# EAGLE board schematic_March8 (EAGLE 7.6.0)
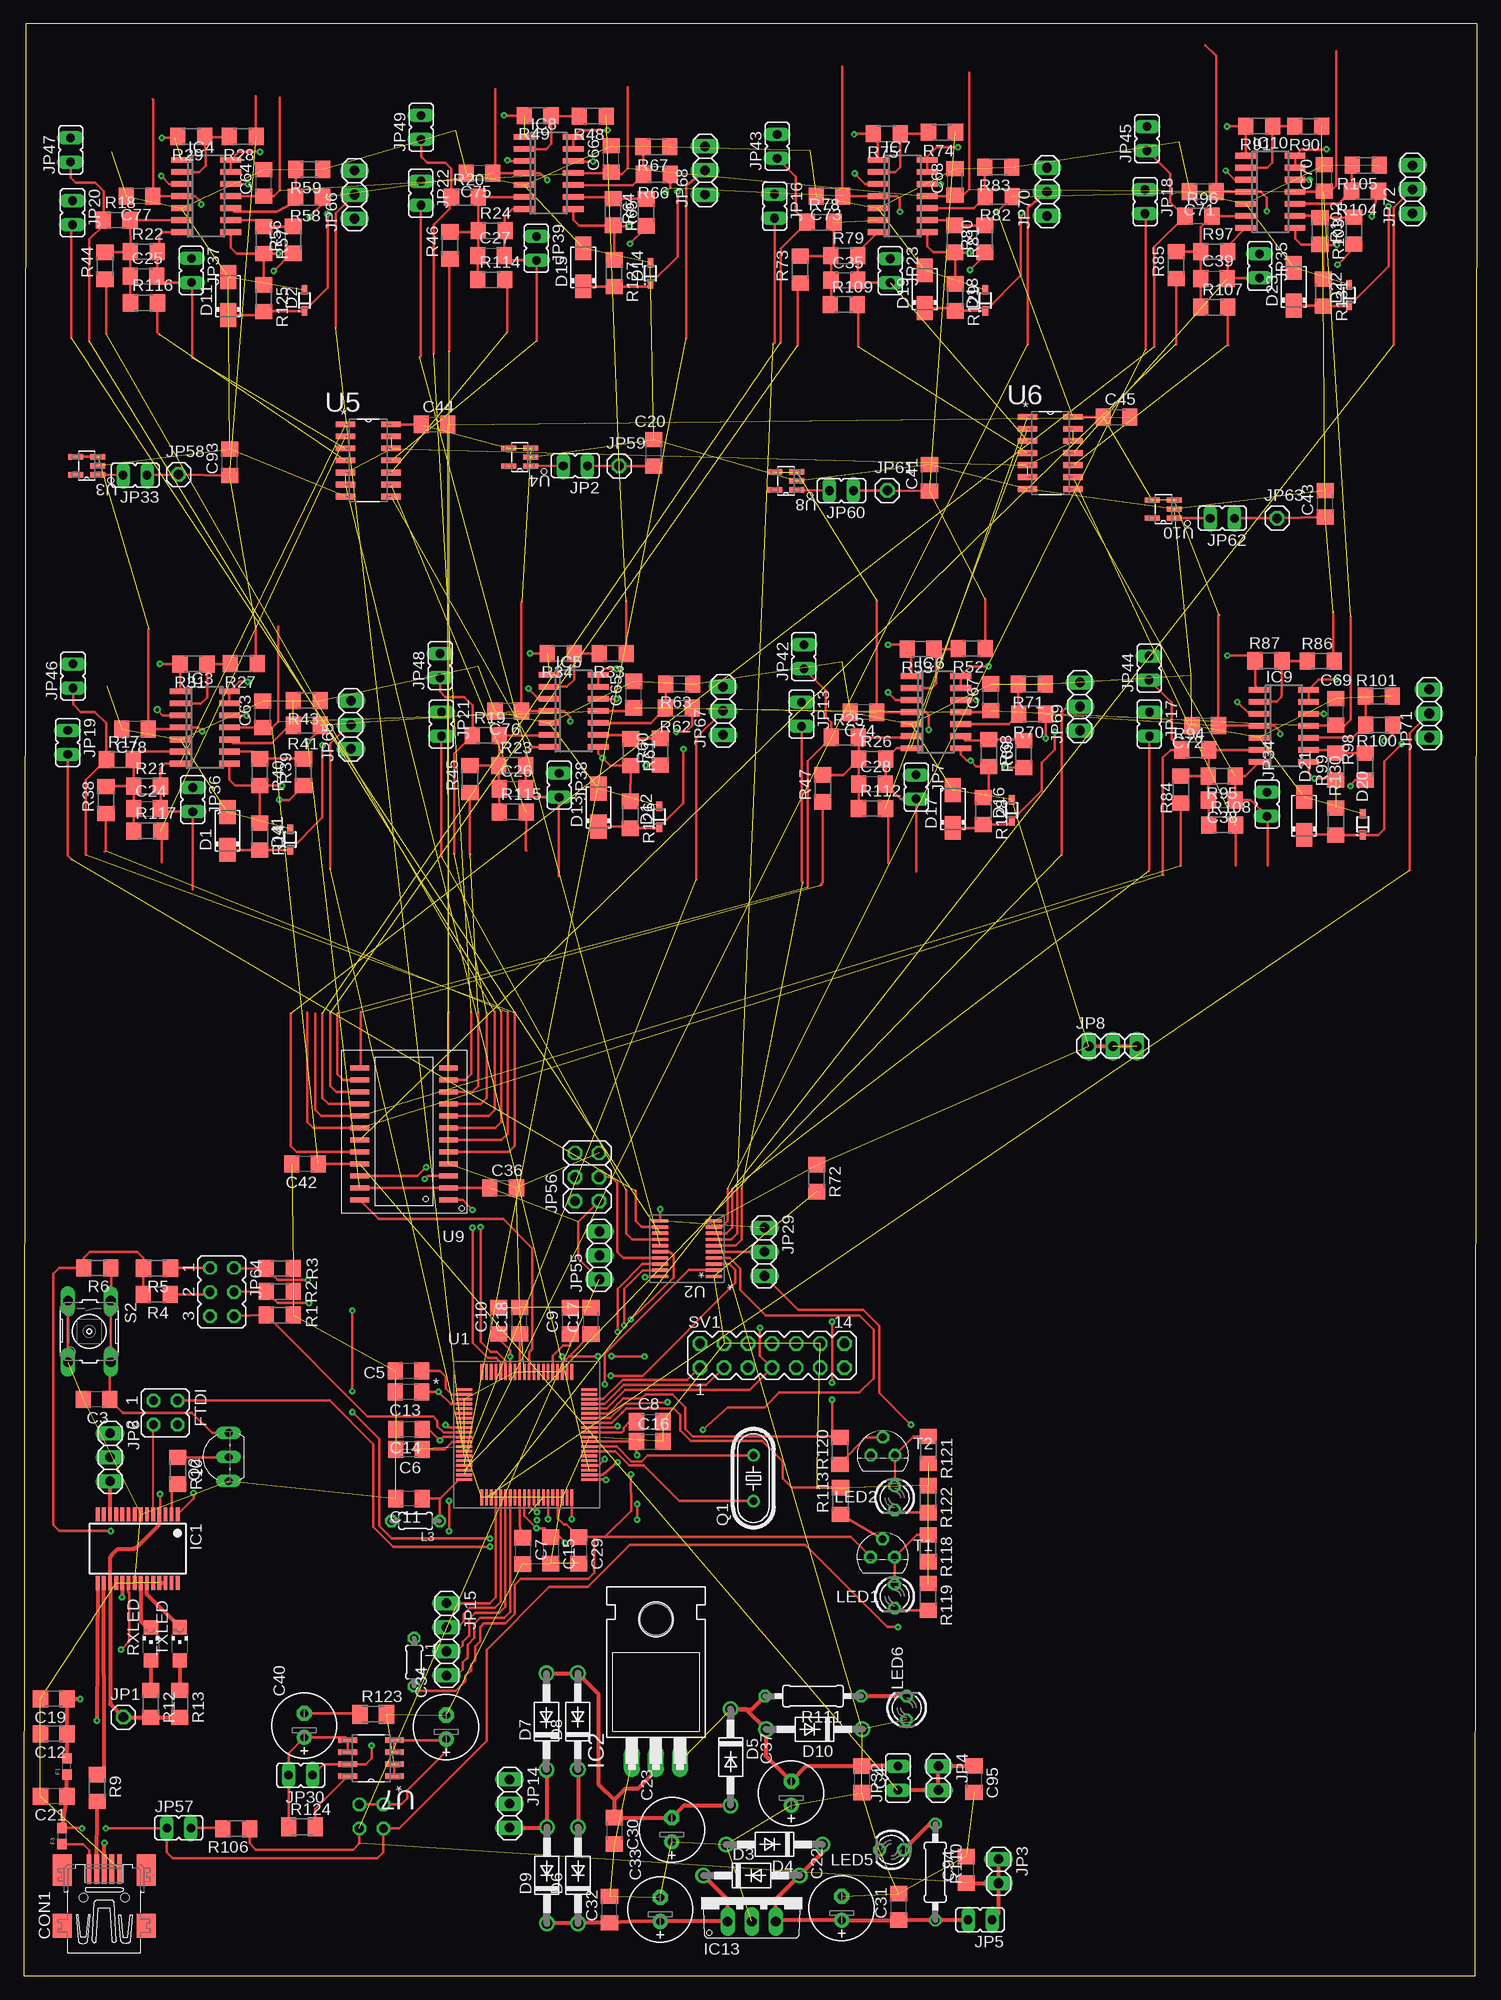
[diagram p2: board, top side]
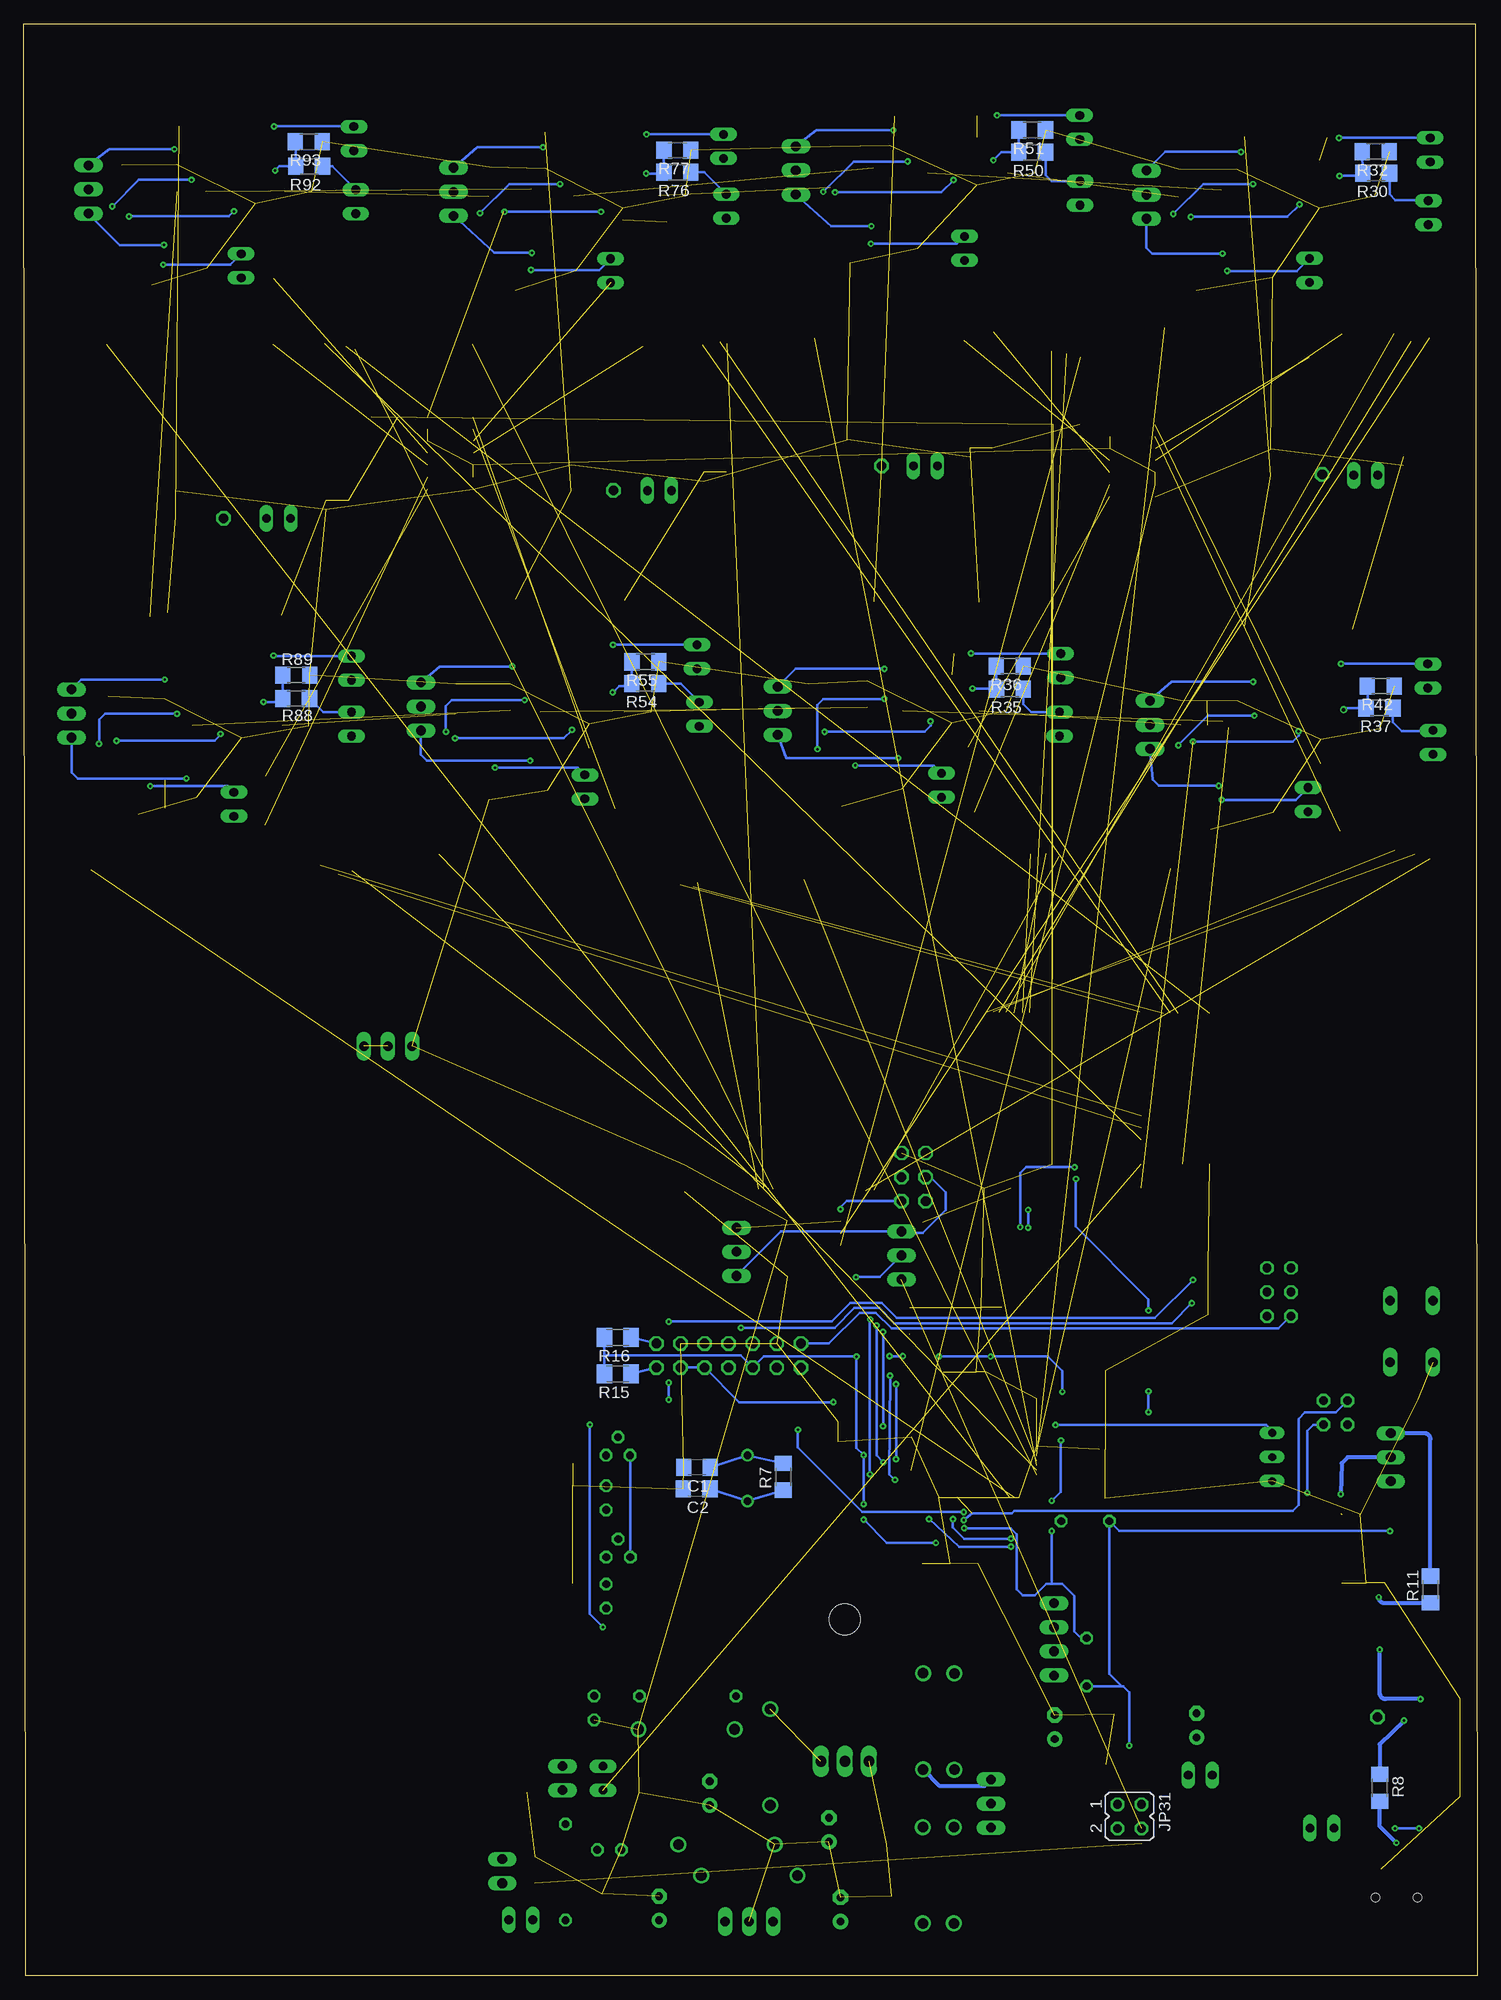
[diagram p3: board, bottom side, seen from below]

Size 153.45 x 206.15 mm. Coordinates in mm from the lower left corner, seen from the top.
Outline: 0,0.03 153.24,0 153.45,206.12 0.2,206.15 0,0.03
Copper layers (1*16): Top 0.035mm / dielectric 1.5mm / Bottom 0.035mm
Design rules "default *": minimum track width 8mil, minimum drill 10mil, track to track 7mil, track to pad 7mil, pad to pad 7mil, via to via 7mil, smd to smd 7mil, copper to edge 10mil, drill to drill 7mil, minimum pad ring 10mil, minimum via ring 8mil, stop-mask expansion 4mil, vias tented up to drill 0mil, thermal gap 10mil
Net classes: 1 power: width 0.254 mm

## Footprints (pad centres in the part's own frame; a part is rotated, then mirrored left to right if it is on the bottom)
C1206 = smd 1.6 x 1.8: 1 -1.4,0; 2 1.4,0
E2,5-7 = drill 0.813 pad 1.6: + -1.27,0 | drill 0.813 pad 1.6 octagon: - 1.27,0
32005-201 = smd 3.1 x 0.5: 1 3,1.6; 2 3,0.8; 3 3,0; 4 3,-0.8; 5 3,-1.6 | smd 2.5 x 2: M1 -3,-4.45; M2 -3,4.45 | smd 3.3 x 2: M3 2.9,4.45; M4 2.9,-4.45 | hole 0.9: 0,2.2; 0,-2.2
DO214AC = smd 2.5 x 1.7: A 2,0; C -2,0
SOD323F = smd 1 x 0.6: A 1.1,0; C -1.1,0
DO41-10 = drill 1.118: A 5.08,0; C -5.08,0
0603 = smd 1.1 x 1: 1 -0.85,0; 2 0.85,0
JP2Q = drill 0.914 octagon: 1 -1.27,-1.27; 2 1.27,-1.27; 3 -1.27,1.27; 4 1.27,1.27
SSOP28 = smd 0.4 x 1.5: 1 -4.225,-3.625; 2 -3.575,-3.625; 3 -2.925,-3.625; 4 -2.275,-3.625; 5 -1.625,-3.625; 6 -0.975,-3.625; 7 -0.325,-3.625; 8 0.325,-3.625; 9 0.975,-3.625; 10 1.625,-3.625; 11 2.275,-3.625; 12 2.925,-3.625; 13 3.575,-3.625; 14 4.225,-3.625; 15 4.225,3.625; 16 3.575,3.625; 17 2.925,3.625; 18 2.275,3.625; 19 1.625,3.625; 20 0.975,3.625; 21 0.325,3.625; 22 -0.325,3.625; 23 -0.975,3.625; 24 -1.625,3.625; 25 -2.275,3.625; 26 -2.925,3.625; 27 -3.575,3.625; 28 -4.225,3.625
TO220H = drill 1.118 long: 1 -2.54,-10.16; 2 0,-10.16; 3 2.54,-10.16 | hole 3.302: 0,4.826
SO14 = smd 0.6 x 2.2: 1 -3.81,-2.6; 2 -2.54,-2.6; 3 -1.27,-2.6; 4 0,-2.6; 5 1.27,-2.6; 6 2.54,-2.6; 7 3.81,-2.6; 8 3.81,2.6; 9 2.54,2.6; 10 1.27,2.6; 11 0,2.6; 12 -1.27,2.6; 13 -2.54,2.6; 14 -3.81,2.6
TO220V = drill 1.016 long: 1 -2.54,-2.54; 2 0,-2.54; 3 2.54,-2.54
1X01 = drill 1.016 octagon: 1 0,0
JP1 = drill 0.914 long: 1 0,-1.27; 2 0,1.27
1X02 = drill 1.016 long: 1 -1.27,0; 2 1.27,0
1X03 = drill 1.016 long: 1 -2.54,0; 2 0,0; 3 2.54,0
1X04 = drill 1.016 long: 1 -3.81,0; 2 -1.27,0; 3 1.27,0; 4 3.81,0
2X03 = drill 1.016 octagon: 1 -2.54,-1.27; 2 -2.54,1.27; 3 0,-1.27; 4 0,1.27; 5 2.54,-1.27; 6 2.54,1.27
JP3Q = drill 0.914 octagon: 1 -2.54,-1.27; 2 -2.54,1.27; 3 0,-1.27; 4 0,1.27; 5 2.54,-1.27; 6 2.54,1.27
0204/5 = drill 0.813 octagon: 1 -2.54,0; 2 2.54,0
LED3MM = drill 0.813 octagon: A -1.27,0; K 1.27,0
HC49/S = drill 0.813: 1 -2.413,0; 2 2.413,0
TO92-EBC = drill 0.813 long: B 0,-1.27; C -2.54,-1.27; E 2.54,-1.27
R1206 = smd 1.6 x 1.803: 1 -1.422,0; 2 1.422,0
M1206 = smd 1.6 x 2: 1 -1.4,0; 2 1.4,0
0207/10 = drill 0.813 octagon: 1 -5.08,0; 2 5.08,0
CHIPLED_1206 = smd 1.5 x 1.5: A 0,-1.75; C 0,1.75
B3F-10XX = drill 1.016 long: 1 -3.251,2.261; 2 3.251,2.261; 3 -3.251,-2.261; 4 3.251,-2.261
MA07-2 = drill 1.016 octagon: 1 -7.62,-1.27; 2 -7.62,1.27; 3 -5.08,-1.27; 4 -5.08,1.27; 5 -2.54,-1.27; 6 -2.54,1.27; 7 0,-1.27; 8 0,1.27; 9 2.54,-1.27; 10 2.54,1.27; 11 5.08,-1.27; 12 5.08,1.27; 13 7.62,-1.27; 14 7.62,1.27
TO92 = drill 0.813 octagon: 1 1.27,0; 2 0,1.905; 3 -1.27,0
PN80 = smd 1.676 x 0.279: 1 -6.617,4.75; 2 -6.617,4.25; 3 -6.617,3.75; 4 -6.617,3.25; 5 -6.617,2.75; 6 -6.617,2.25; 7 -6.617,1.75; 8 -6.617,1.25; 9 -6.617,0.75; 10 -6.617,0.25; 11 -6.617,-0.25; 12 -6.617,-0.75; 13 -6.617,-1.25; 14 -6.617,-1.75; 15 -6.617,-2.25; 16 -6.617,-2.75; 17 -6.617,-3.25; 18 -6.617,-3.75; 19 -6.617,-4.25; 20 -6.617,-4.75; 41 6.617,-4.75; 42 6.617,-4.25; 43 6.617,-3.75; 44 6.617,-3.25; 45 6.617,-2.75; 46 6.617,-2.25; 47 6.617,-1.75; 48 6.617,-1.25; 49 6.617,-0.75; 50 6.617,-0.25; 51 6.617,0.25; 52 6.617,0.75; 53 6.617,1.25; 54 6.617,1.75; 55 6.617,2.25; 56 6.617,2.75; 57 6.617,3.25; 58 6.617,3.75; 59 6.617,4.25; 60 6.617,4.75 | smd 0.279 x 1.676: 21 -4.75,-6.617; 22 -4.25,-6.617; 23 -3.75,-6.617; 24 -3.25,-6.617; 25 -2.75,-6.617; 26 -2.25,-6.617; 27 -1.75,-6.617; 28 -1.25,-6.617; 29 -0.75,-6.617; 30 -0.25,-6.617; 31 0.25,-6.617; 32 0.75,-6.617; 33 1.25,-6.617; 34 1.75,-6.617; 35 2.25,-6.617; 36 2.75,-6.617; 37 3.25,-6.617; 38 3.75,-6.617; 39 4.25,-6.617; 40 4.75,-6.617; 61 4.75,6.617; 62 4.25,6.617; 63 3.75,6.617; 64 3.25,6.617; 65 2.75,6.617; 66 2.25,6.617; 67 1.75,6.617; 68 1.25,6.617; 69 0.75,6.617; 70 0.25,6.617; 71 -0.25,6.617; 72 -0.75,6.617; 73 -1.25,6.617; 74 -1.75,6.617; 75 -2.25,6.617; 76 -2.75,6.617; 77 -3.25,6.617; 78 -3.75,6.617; 79 -4.25,6.617; 80 -4.75,6.617
PW20 = smd 1.676 x 0.356: 1 -2.819,2.925; 2 -2.819,2.275; 3 -2.819,1.625; 4 -2.819,0.975; 5 -2.819,0.325; 6 -2.819,-0.325; 7 -2.819,-0.975; 8 -2.819,-1.625; 9 -2.819,-2.275; 10 -2.819,-2.925; 11 2.819,-2.925; 12 2.819,-2.275; 13 2.819,-1.625; 14 2.819,-0.975; 15 2.819,-0.325; 16 2.819,0.325; 17 2.819,0.975; 18 2.819,1.625; 19 2.819,2.275; 20 2.819,2.925
DDC0005A_N = smd 1.575 x 0.559: 1 -1.168,0.95; 2 -1.168,0; 3 -1.168,-0.95; 4 1.168,-0.95; 5 1.168,0.95
SOIC127P600X175-14N = smd 2.057 x 0.61: 1 -4.801,7.62; 2 -4.801,6.35; 3 -4.801,5.08; 4 -4.801,3.81; 5 -4.801,2.54; 6 -4.801,1.27; 7 -4.801,0; 8 0,0; 9 0,1.27; 10 0,2.54; 11 0,3.81; 12 0,5.08; 13 0,6.35; 14 0,7.62
SOIC127P600X175-8N = smd 1.981 x 0.559: 1 -2.464,1.905; 2 -2.464,0.635; 3 -2.464,-0.635; 4 -2.464,-1.905; 5 2.464,-1.905; 6 2.464,-0.635; 7 2.464,0.635; 8 2.464,1.905
21-0042B_24 = smd 1.981 x 0.533: 1 -4.686,6.985; 2 -4.686,5.715; 3 -4.686,4.445; 4 -4.686,3.175; 5 -4.686,1.905; 6 -4.686,0.635; 7 -4.686,-0.635; 8 -4.686,-1.905; 9 -4.686,-3.175; 10 -4.686,-4.445; 11 -4.686,-5.715; 12 -4.686,-6.985; 13 4.686,-6.985; 14 4.686,-5.715; 15 4.686,-4.445; 16 4.686,-3.175; 17 4.686,-1.905; 18 4.686,-0.635; 19 4.686,0.635; 20 4.686,1.905; 21 4.686,3.175; 22 4.686,4.445; 23 4.686,5.715; 24 4.686,6.985

## Placement (x,y rotation side)
C1  36p  [C1206]  82.37,53.67 180 bottom
C2  36p  [C1206]  82.4,51.41 180 bottom
C3  0.1u  [C1206]  7.67,60.86 180 top
C4  0.1uF  [C1206]  88.47,20.75 270 top
C5  2.2u  [C1206]  40.64,63.88 180 top
C6  2.2u  [C1206]  40.67,55.6 180 top
C7  2.2u  [C1206]  52.68,44.88 270 top
C8  2.2u  [C1206]  66.09,58.52 0 top
C9  2.2u  [C1206]  57.68,69.16 90 top
C10  2.2u  [C1206]  50.16,69.19 90 top
C11  2.2u  [C1206]  40.67,50.39 180 top
C12  100nF  [C1206]  3.17,25.55 180 top
C13  2.2u  [C1206]  40.64,61.67 180 top
C14  2.2u  [C1206]  40.67,57.71 180 top
C15  2.2u  [C1206]  55.63,44.93 270 top
C16  2.2u  [C1206]  66.09,56.41 0 top
C17  2.2u  [C1206]  59.89,69.16 90 top
C18  2.2u  [C1206]  52.35,69.19 90 top
C19  4.7uF  [C1206]  3.17,29.24 180 top
C20  2.2u  [C1206]  66.5,160.81 90 top
C21  10nF  [C1206]  3.17,18.95 180 top
C22  10uF  [E2,5-7]  86.36,7.14 90 top
C23  1000uF  [E2,5-7]  68.43,15.42 90 top
C24  [C1206]  13.03,123.24 0 top
C25  [C1206]  12.65,179.5 0 top
C26  [C1206]  51.61,125.35 0 top
C27  [C1206]  49.35,181.66 0 top
C28  [C1206]  89.56,125.83 0 top
C29  0.1u  [C1206]  58.6,44.93 270 top
C30  0.1uF  [C1206]  62.36,15.32 270 top
C31  0.1uF  [C1206]  92.38,7.29 90 top
C32  0.1uF  [C1206]  61.85,7.01 90 top
C33  1000uF  [E2,5-7]  67.21,7.01 90 top
C34  0.1uF  [E2,5-7]  44.6,26.26 90 top
C35  [C1206]  86.64,179.04 0 top
C36  2.2u  [C1206]  50.62,83.19 0 top
C37  10uF  [E2,5-7]  81.03,19.28 90 top
C38  [C1206]  126.49,124.16 0 top
C39  [C1206]  125.65,179.22 0 top
C40  10uF  [E2,5-7]  29.62,26.44 90 top
C41  2.2u  [C1206]  95.63,158.19 90 top
C42  2.2u  [C1206]  29.69,85.73 180 top
C43  2.2u  [C1206]  137.41,155.45 90 top
C44  2.2u  [C1206]  43.36,163.83 0 top
C45  2.2u  [C1206]  115.37,164.62 0 top
C63  2.2u  [C1206]  25.25,133.2 90 top
C64  2.2u  [C1206]  25.32,189.33 90 top
C65  2.2u  [C1206]  64.41,135.31 90 top
C66  2.2u  [C1206]  62.03,191.87 90 top
C67  2.2u  [C1206]  102.08,135.03 90 top
C68  2.2u  [C1206]  98.32,189.43 90 top
C69  2.2u  [C1206]  138.53,133.48 90 top
C70  2.2u  [C1206]  137.29,189.84 90 top
C71  2.2u  [C1206]  124.49,188.42 180 top
C72  2.2u  [C1206]  124.74,132 180 top
C73  2.2u  [C1206]  85.06,187.93 180 top
C74  2.2u  [C1206]  88.65,133.43 180 top
C75  2.2u  [C1206]  48.13,190.35 180 top
C76  2.2u  [C1206]  51.16,133.58 180 top
C77  2.2u  [C1206]  12.24,187.91 180 top
C78  2.2u  [C1206]  11.76,131.67 180 top
C93  2.2u  [C1206]  21.77,159.82 90 top
C94  2.2u  [C1206]  99.49,11.2 90 top
C95  2.2u  [C1206]  100.33,20.78 270 top
CON1  UBC05V128-B0C04D  [32005-201]  8.51,8.28 90 top
D1  1SMA5913BT3G  [DO214AC]  21.51,120.9 90 top
D2  1N914BWS  [SOD323F]  29.64,176.91 90 top
D3  1N4004  [DO41-10]  76.83,10.59 0 top
D4  1N4004  [DO41-10]  79.25,13.87 180 top
D5  1N4004  [DO41-10]  74.63,23.09 270 top
D6  1N4004  [DO41-10]  58.52,10.62 90 top
D7  1N4004  [DO41-10]  55.19,26.85 90 top
D8  1N4004  [DO41-10]  58.5,26.87 90 top
D9  1N4004  [DO41-10]  55.24,10.62 90 top
D10  1N4004  [DO41-10]  83.46,26.04 180 top
D11  1SMA5913BT3G  [DO214AC]  21.59,177.37 90 top
D12  1N914BWS  [SOD323F]  67.11,122.4 90 top
D13  1SMA5913BT3G  [DO214AC]  60.68,123.37 90 top
D14  1N914BWS  [SOD323F]  66.17,179.78 90 top
D15  1SMA5913BT3G  [DO214AC]  59.08,180.42 90 top
D16  1N914BWS  [SOD323F]  104.32,123.09 90 top
D17  1SMA5913BT3G  [DO214AC]  98.09,123.22 90 top
D18  1N914BWS  [SOD323F]  101.52,176.91 90 top
D19  1SMA5913BT3G  [DO214AC]  95.12,178.1 90 top
D20  1N914BWS  [SOD323F]  141.38,121.59 90 top
D21  1SMA5913BT3G  [DO214AC]  135.18,122.5 90 top
D22  1N914BWS  [SOD323F]  139.93,177.47 90 top
D23  1SMA5913BT3G  [DO214AC]  134.09,178.36 90 top
D41  1N914BWS  [SOD323F]  28.14,119.99 90 top
F1  500mA  [0603]  4.57,22.12 90 top
F3  500mA  [0603]  4.06,14.76 90 top
FTDI  [JP2Q]  14.96,59.46 270 top
IC1  FT232RL  [SSOP28]  12.04,45.11 180 top
IC2  [TO220H]  66.75,32.82 0 top
IC3  TL084D  [SO14]  19.13,131.83 270 top
IC4  TL084D  [SO14]  19.25,187.93 270 top
IC5  TL084D  [SO14]  58.06,133.58 270 top
IC6  TL084D  [SO14]  96.32,133.45 270 top
IC7  TL084D  [SO14]  92.79,187.93 270 top
IC8  TL084D  [SO14]  55.42,190.37 270 top
IC9  TL084D  [SO14]  133.05,132 270 top
IC10  TL084D  [SO14]  131.62,188.39 270 top
IC13  7805TV  [TO220V]  76.86,8.28 0 top
JP1  [1X01]  10.52,27.31 0 top
JP2  [JP1]  58.24,159.46 90 top
JP3  [1X02]  102.92,11.05 270 top
JP4  [1X02]  96.57,20.88 270 top
JP5  [JP1]  100.97,5.92 90 top
JP6  [1X03]  9.12,54.76 270 top
JP7  [JP1]  94.21,125.55 180 top
JP8  [1X03]  114.99,98.17 0 top
JP13  [JP1]  82.12,133.22 180 top
JP14  [1X03]  51.31,18.19 270 top
JP15  [1X04]  44.65,35.53 270 top
JP16  [JP1]  79.27,186.87 180 top
JP17  [JP1]  118.85,132.18 180 top
JP18  [JP1]  118.39,187.35 180 top
JP19  [JP1]  4.65,130.25 180 top
JP20  [JP1]  5.16,186.18 180 top
JP21  [JP1]  44.09,132.18 180 top
JP22  [JP1]  41.94,188.24 180 top
JP23  [JP1]  91.49,180.06 180 top
JP29  [1X03]  78.21,76.45 270 top
JP30  [JP1]  29.24,21.18 90 top
JP31  [JP2Q]  36.7,16.84 270 bottom
JP32  [JP1]  92.3,20.88 0 top
JP33  [JP1]  11.76,158.47 90 top
JP34  pls  [JP1]  131.27,123.72 180 top
JP35  [JP1]  130.48,180.57 180 top
JP36  [JP1]  17.86,124.21 180 top
JP37  [JP1]  17.7,180.09 180 top
JP38  [JP1]  56.54,125.73 180 top
JP39  [JP1]  54.13,182.42 180 top
JP42  [JP1]  82.37,139.29 0 top
JP43  [JP1]  79.55,193.19 0 top
JP44  Int_inp  [JP1]  118.82,138.1 0 top
JP45  [JP1]  118.59,194.01 0 top
JP46  [JP1]  5.21,137.26 0 top
JP47  [JP1]  4.95,192.81 0 top
JP48  [JP1]  43.97,138.35 0 top
JP49  [JP1]  41.96,195.2 0 top
JP55  [1X03]  60.78,76.07 90 top
JP56  [2X03]  59.49,84.35 90 top
JP57  [JP1]  16.38,15.62 270 top
JP58  [1X01]  16.36,158.55 0 top
JP59  [1X01]  62.87,159.44 0 top
JP60  [JP1]  86.33,156.84 90 top
JP61  [1X01]  91.19,156.84 0 top
JP62  [JP1]  126.54,153.92 90 top
JP63  [1X01]  132.33,153.92 0 top
JP64  [JP3Q]  20.93,72.21 270 top
JP65  [1X03]  34.54,132.11 90 top
JP66  [1X03]  34.92,188.09 90 top
JP67  [1X03]  73.84,133.58 90 top
JP68  [1X03]  71.93,190.65 90 top
JP69  [1X03]  111.51,134.04 90 top
JP70  [1X03]  108.05,188.39 90 top
JP71  [1X03]  148.39,133.3 90 top
JP72  [1X03]  146.61,188.65 90 top
L1  BKP1005HS221-T  [0204/5]  41.22,33.12 270 top
L3  BKP1005HS221-T  [0204/5]  41.38,48.03 180 top
LED1  [LED3MM]  91.95,40.08 270 top
LED2  [LED3MM]  91.95,50.47 270 top
LED5  [LED3MM]  91.62,13.31 180 top
LED6  [LED3MM]  93.22,28.3 90 top
Q1  [HC49/S]  77.04,52.55 90 top
Q2  BC557  [TO92-EBC]  20.37,54.79 90 top
R1  2.2k  [R1206]  27.03,69.77 180 top
R2  2.2k  [R1206]  27.03,72.26 180 top
R3  2.2k  [R1206]  27.03,74.7 180 top
R4  820  [R1206]  14.05,71.96 180 top
R5  820  [R1206]  14.07,74.73 180 top
R6  2.2k  [R1206]  7.77,74.75 180 top
R7  1M  [R1206]  73.25,52.71 90 bottom
R8  33  [R1206]  10.29,19.86 270 bottom
R9  33  [R1206]  7.75,19.84 270 top
R10  2.2k  [R1206]  16.28,53.34 270 top
R11  10k  [R1206]  4.93,40.79 90 bottom
R12  270  [R1206]  13.41,28.73 270 top
R13  270  [R1206]  16.48,28.73 270 top
R14  [R1206]  24.94,120.32 270 top
R15  4.7k  [M1206]  90.73,63.55 180 bottom
R16  4.7k  [M1206]  90.73,67.41 180 bottom
R17  [R1206]  10.16,128.42 0 top
R18  [R1206]  9.8,185.39 0 top
R19  [R1206]  48.79,130.99 0 top
R20  [R1206]  46.58,187.81 0 top
R21  [R1206]  13.03,125.63 0 top
R22  [R1206]  12.67,182.07 0 top
R23  [R1206]  51.59,127.81 0 top
R24  [R1206]  49.4,184.28 0 top
R25  [R1206]  86.69,130.78 0 top
R26  [R1206]  89.59,128.47 0 top
R27  [R1206]  23.24,138.56 180 top
R28  [R1206]  23.11,194.23 180 top
R29  [R1206]  17.68,194.23 180 top
R30  [R1206]  10.67,190.37 180 bottom
R31  [R1206]  17.93,138.53 180 top
R32  [R1206]  10.69,192.63 180 bottom
R33  [R1206]  62.18,139.65 180 top
R34  [R1206]  56.69,139.62 180 top
R35  [R1206]  49.33,135.89 180 bottom
R36  [R1206]  49.35,138.3 180 bottom
R37  [R1206]  10.31,133.88 180 bottom
R38  [R1206]  8.69,124.16 90 top
R39  [R1206]  29.54,127.1 90 top
R40  [R1206]  24.92,127.1 270 top
R41  [R1206]  29.87,132.05 180 top
R42  [R1206]  10.19,136.19 180 bottom
R43  [R1206]  29.9,134.67 180 top
R44  [R1206]  8.59,180.57 90 top
R45  [R1206]  47.12,126.39 90 top
R46  [R1206]  45.01,182.73 90 top
R47  [R1206]  84.38,125.4 90 top
R48  [R1206]  60.07,196.39 180 top
R49  [R1206]  54.25,196.44 180 top
R50  [R1206]  46.99,192.56 180 bottom
R51  [R1206]  46.99,194.92 180 bottom
R52  [R1206]  100.1,140.16 180 top
R53  [R1206]  94.69,140.11 180 top
R54  [R1206]  87.83,136.47 180 bottom
R55  [R1206]  87.81,138.76 180 bottom
R56  [R1206]  28.45,183.31 90 top
R57  [R1206]  25.35,183.29 270 top
R58  [R1206]  30.12,187.81 180 top
R59  [R1206]  30.15,190.75 180 top
R60  [R1206]  67.21,129.26 90 top
R61  [R1206]  64.11,129.21 270 top
R62  [R1206]  69.16,133.86 180 top
R63  [R1206]  69.22,136.42 180 top
R64  [R1206]  65.71,186.21 90 top
R65  [R1206]  62.23,186.26 270 top
R66  [R1206]  66.85,190.22 180 top
R67  [R1206]  66.8,193.14 180 top
R68  [R1206]  105.56,129.01 90 top
R69  [R1206]  101.9,129.13 270 top
R70  [R1206]  106.48,133.25 180 top
R71  [R1206]  106.43,136.4 180 top
R72  0  [R1206]  83.72,84.23 270 top
R73  [R1206]  81.97,180.16 90 top
R74  [R1206]  96.95,194.67 180 top
R75  [R1206]  91.11,194.51 180 top
R76  [R1206]  84.43,190.45 180 bottom
R77  [R1206]  84.43,192.79 180 bottom
R78  [R1206]  84.12,185.17 0 top
R79  [R1206]  86.64,181.64 0 top
R80  [R1206]  101.45,183.41 90 top
R81  [R1206]  98.3,183.41 270 top
R82  [R1206]  102.95,187.88 180 top
R83  [R1206]  102.9,191.01 180 top
R84  [R1206]  122.17,125.27 90 top
R85  [R1206]  121.67,180.64 90 top
R86  [R1206]  136.93,138.84 180 top
R87  [R1206]  131.42,138.86 180 top
R88  [R1206]  124.69,134.87 180 bottom
R89  [R1206]  124.66,137.36 180 bottom
R90  [R1206]  135.61,195.3 180 top
R91  [R1206]  130.43,195.33 180 top
R92  [R1206]  123.32,191.08 180 bottom
R93  [R1206]  123.34,193.68 180 bottom
R94  [R1206]  123.67,129.46 0 top
R95  [R1206]  126.49,126.7 0 top
R96  [R1206]  124.03,185.83 0 top
R97  [R1206]  125.68,182.07 0 top
R98  [R1206]  141.63,127.69 90 top
R99  [R1206]  138.53,127.71 270 top
R100  [R1206]  143.1,132.08 180 top
R101  [R1206]  143.08,135.13 180 top
R102  [R1206]  140.44,184.28 90 top
R103  [R1206]  136.86,184.25 270 top
R104  [R1206]  141.6,188.44 180 top
R105  [R1206]  141.68,191.19 180 top
R106  0  [R1206]  22.45,15.54 180 top
R107  [R1206]  125.68,176.2 0 top
R108  [R1206]  126.54,121.54 0 top
R109  [R1206]  86.59,176.48 0 top
R110  1K  [0207/10]  96.24,10.95 270 top
R111  1K  [0207/10]  83.34,29.54 180 top
R112  [R1206]  89.56,123.27 0 top
R113  470  [R1206]  86.23,50.14 90 top
R114  [R1206]  49.38,179.1 0 top
R115  [R1206]  51.64,122.91 0 top
R116  [R1206]  12.7,176.66 0 top
R117  [R1206]  13.06,120.9 0 top
R118  10k  [R1206]  95.48,45.16 270 top
R119  470  [R1206]  95.48,40.01 270 top
R120  470  [R1206]  86.18,55.45 90 top
R121  10k  [R1206]  95.5,55.52 270 top
R122  470  [R1206]  95.48,50.34 270 top
R123  1  [M1206]  36.91,27.64 0 top
R124  1  [M1206]  29.39,15.72 0 top
R125  [R1206]  25.35,177.14 270 top
R126  [R1206]  64.06,122.61 270 top
R127  [R1206]  62.33,179.78 270 top
R128  [R1206]  101.32,123.01 270 top
R129  [R1206]  98.35,177.24 270 top
R130  [R1206]  138.53,121.89 270 top
R131  [R1206]  137.21,177.75 270 top
RXLED  [CHIPLED_1206]  13.44,35.05 0 top
S2  [B3F-10XX]  6.93,68.05 270 top
SV1  JTAG  [MA07-2]  79.02,65.51 0 top
T1  BC547  [TO92]  90.68,44.22 0 top
T2  BC547  [TO92]  90.7,54.97 0 top
TXLED  [CHIPLED_1206]  16.48,35.08 0 top
U1  TMS320F28069_PN_80  [PN80]  53.11,57.15 0 top
U2  TLV5610_PW_20  [PW20]  70.03,76.78 180 top
U3  REF2030AIDDCR  [DDC0005A_N]  6.65,159.46 180 top
U4  REF2030AIDDCR  [DDC0005A_N]  52.37,160.38 180 top
U5  TS12A44514DR  [SOIC127P600X175-14N]  38.79,156.21 0 top
U6  TS12A44514DR  [SOIC127P600X175-14N]  110.79,157 0 top
U7  TPS7333QD  [SOIC127P600X175-8N]  36.68,22.99 180 top
U8  REF2030AIDDCR  [DDC0005A_N]  80.47,157.86 180 top
U9  MAX395CWG+  [21-0042B_24]  40.16,88.9 180 top
U10  REF2030AIDDCR  [DDC0005A_N]  120.32,154.89 180 top

## Tracks (layer width: path | path; a pad name or v marks a point on that pad's centre or on a via)
3V3_OUT  (via drill 0.25)  (1 unrouted)
  Top 0.254: 14.4,48.82 v14.4,50.88
  Top 0.406: IC1.4 14.31,47.9 arc-45 14.13,47.45 11.95,45.27 arc-45 11.5,45.09 9.96,45.09 9.3,44.43 arc45 9.12,43.98 IC1.17 9.12,28.71 JP1.1 | JP1.1 | JP1.1 R12.2 R13.2 | v14.4,50.88 14.31,50.86
  Bottom 0.406: JP6.2 13.66,54.76 14.3,54.13 v14.4,50.88
+1.5V1  (2 unrouted)
  Top 0.254: JP33.1 JP58.1 C93.1 | R28.1 24.49,194.28 24.49,198.5 | R27.1 24.51,138.71 24.51,142.54
+1.5V2  (2 unrouted)
  Top 0.254: JP2.1 JP59.1 C20.1 | R33.1 63.63,139.68 63.63,145.14
+1.5V3  (2 unrouted)
  Top 0.254: JP60.1 JP61.1 C41.1 | R52.1 101.5,140.18 101.5,145.39
+1.5V4  (2 unrouted)
  Top 0.254: JP62.1 JP63.1 C43.1 | R86.1 138.25,138.94 138.25,143.94
+3V3  (via drill 0.25)
  Top 0.254: JP30.1 31.67,22.35 U7.7 36.09,22.35 36.73,22.99 v36.73,24.31 | R4.2 12.65,71.98 R5.2 12.65,75.82 12.02,76.45 6.99,76.45 6.35,75.82 R6.2 3.73,74.75 3.1,74.12 3.1,47.6 3.73,46.96 v9.2,46.96 | U1.37 56.36,48.31 57,47.68 57.3,47.68 58.6,46.38 C29.1 | C29.1 58.7,46.31 | L1.2 41.73,30.07 45.59,30.07 46.63,31.12 46.63,31.67 47.24,32.28 47.24,32.89 47.65,33.3 47.65,34.77 48.18,35.31 48.18,36.8 48.59,37.21 50.85,37.21 51.84,38.2 51.84,41.28 52.48,41.91 59.59,41.91 60.22,42.55 60.22,44.15 | U2.16 68.19,76.46 68.61,76.05 68.61,73.74 66.42,71.55 v64.08,69.32 | v64.11,52.96 64.14,49.1 61.37,46.33 | 58.19,46.56 C29.1 | 61.37,46.33 60.22,46.33 | 60.22,46.33 C29.1 | 60.22,44.15 60.22,46.33 | 60.3,44.22 60.22,44.15 | T1.3 87.3,46.33 61.37,46.33
  Bottom 0.254: v36.73,24.31 36.7,24.33 36.7,29.92 37.36,30.58 37.54,30.58 | 37.54,30.58 L1.2 | 37.54,30.58 38.84,31.88 L3.2 37.77,46.96 v9.2,46.96 | v64.11,52.96 64.14,69.32 v64.08,69.32 | T2.3 89.41,54.94 T1.3
+5V  (via drill 0.25)  (21 unrouted)
  Top 0.254: U3.3 U3.4 | C36.1 U9.2 U9.23 | U5.14 C44.1 | U6.14 C45.1 | R106.1 23.88,13.97 24.51,13.34 34.8,13.34 35.43,13.97 JP31.4 | 13.18,142.19 13.16,142.17 C78.1 16.37,131.67 IC3.4 18.44,131.83 v18.85,131.42 | IC6.4 93.69,133.43 | 13.67,187.93 13.67,198.09 13.61,198.15 | C77.1 13.67,187.93 | 13.67,187.93 IC4.4 18.11,187.93 18.75,187.3 v18.75,187.05 | 52.6,145.06 52.56,145.01 C76.1 IC5.4 57.07,133.58 57.71,132.94 v57.71,132.49 | 49.78,199.24 49.78,190.6 C75.1 52.8,190.35 IC8.4 54.53,190.37 v55.27,189.64 | C74.1 90.07,133.45 | 90.07,133.45 90.07,145.24 | 90.07,133.45 IC6.4 | 86.41,201.57 86.41,187.99 C73.1 IC7.4 92.23,187.93 92.51,187.66 v92.51,186.28 | 124.77,203.86 125.89,202.74 C71.1 129,188.42 | 129,188.42 IC10.4 | R70.1 v107.9,130.68 | v107.9,130.68 | v95.56,131.57 95.56,133.15 95.28,133.43 93.74,133.43 IC6.4 | 126.21,143.71 126.14,143.64 C72.1 IC9.4 132.03,132 132.66,131.37 v132.66,131.14 | R104.1 v142.32,185.8 | v142.32,185.8 | v131.24,186.33 131.24,187.76 130.58,188.42 129,188.42 | JP56.1 58.55,79.6 58.55,75.77 JP55.1 | U2.11 v67.21,80.95 | v68.89,131.37 69.95,131.37 70.59,132 R62.1 | v30,130.33 31.29,131.62 R41.1 | v143.64,130.43 143.89,130.43 144.53,131.06 R100.1 | v30.23,185.75 31.55,187.07 R58.1 | v67.79,188.34 68.28,188.82 R66.1 | v102.69,186.28 102.77,186.28 R82.1
  Top 0.406: JP3.2 JP3.1 | JP5.1 102.92,6.6 JP3.2 | C94.1 99.51,9.78 JP3.2
  Bottom 0.254: v107.9,130.68 96.44,130.68 v95.56,131.57 | v102.69,186.28 v92.51,186.28 | v142.32,185.8 131.78,185.8 v131.24,186.33 | JP56.1 66.57,81.81 67.21,81.18 v67.21,80.95 | v57.71,132.49 57.71,132 58.34,131.37 v68.89,131.37 | v18.85,131.42 18.85,130.96 19.48,130.33 v30,130.33 | v132.66,131.14 132.66,131.06 133.3,130.43 v143.64,130.43 | v18.75,187.05 20.04,185.75 v30.23,185.75 | v55.27,189.64 56.57,188.34 v67.79,188.34
-5V  (9 unrouted)
  Top 0.254: C42.1 U9.21 | IC3.11 23.85,131.83 C63.1 26.24,131.8 26.87,132.43 26.87,142.47 | IC4.11 21.88,187.91 C64.1 26.39,187.93 27.03,188.57 27.03,198.32 | 64.36,133.55 64.39,133.58 C65.1 64.41,133.58 IC5.11 | 95.48,188.03 IC7.11 98.22,187.93 C68.1 99.21,188.03 99.85,188.67 99.85,200.99 | 101.75,133.45 C67.1 101.91,133.45 IC6.11 | 138.46,132 139.47,132 140.11,132.64 140.11,143.54 | IC9.11 138.46,132 | 138.46,132 C69.1 | 63.78,199.44 63.78,190.9 63.14,190.27 62.23,190.27 C66.1 | 62.08,190.37 C66.1 | IC8.11 61.93,190.37 C66.1 | 138.58,203.25 138.58,189.03 138,188.44 C70.1 137.24,188.39 IC10.11
  Top 0.406: JP32.1 JP4.2 JP4.1 100.3,22.15 C95.1
?????
  Top 0.254: U2.17 63.32,75.81 62.69,76.44 62.69,83.72 62.05,84.35 JP56.3
ADCINA0  (1 unrouted)
  Top 0.254: JP70.2 106.02,186.72 106.02,172.29
ADCINA1  (1 unrouted)
  Top 0.254: JP69.2 110.21,134.06 109.58,133.43 109.58,118.39
ADCINA2  (1 unrouted)
  Top 0.254: JP68.2 69.93,189.05 69.93,172.95
ADCINA4  (1 unrouted)
  Top 0.254: JP67.2 71.02,130.76 71.02,115.75
ADCINA5  (1 unrouted)
  Top 0.254: JP66.2 32.97,186.13 32.97,174.07
ADCINA6  (1 unrouted)
  Top 0.254: 32.36,116.92 32.36,130.12 34.34,132.11 JP65.2
ADCINB0  (1 unrouted)
  Top 0.254: JP71.2 146.33,131.24 146.33,116.79
ADCINB1  (1 unrouted)
  Top 0.254: JP72.2 144.65,186.69 144.65,172.26
ADCINB2
  Top 0.254: JP15.1 49.23,39.34 49.86,39.98 U1.24
ADCINB4
  Top 0.254: JP15.2 45.82,36.8 46.46,37.44 46.46,38.2 47.09,38.84 49.73,38.84 50.36,39.47 U1.25
ADCINB5
  Top 0.254: JP15.3 45.72,34.26 46.35,34.9 46.35,35.26 46.99,35.89 47.02,35.89 47.02,37.69 47.65,38.33 50.23,38.33 50.86,38.96 U1.26
ADCINB6
  Top 0.254: JP15.4 45.74,31.72 46.38,32.36 46.38,33.12 46.74,33.48 46.76,33.48 46.86,33.58 46.86,34.98 47.57,35.69 47.57,37.19 48.21,37.82 50.73,37.82 51.36,38.46 U1.27
AGND  (85 unrouted)
  Top 0.406: JP8.1 JP8.3
BUFIN1  (via drill 0.25)
  Top 0.254: D1.C 21.16,118.9 R14.2 28.14,118.9 D41.C 31.55,122.29 v31.55,129.95 | IC3.12 23.5,133.1 v23.52,133.07
  Bottom 0.254: v23.52,133.07 28.42,133.07 v31.55,129.95
BUFIN2  (via drill 0.25)
  Top 0.254: D11.C 25,175.37 R125.2 25.44,175.81 D2.C 32.08,178.25 v32.08,186.06 | IC4.12 v23.67,189.2
  Bottom 0.254: v23.67,189.2 28.93,189.2 v32.08,186.06
BUFIN3  (via drill 0.25)
  Top 0.254: D13.C 63.88,121.37 R126.2 66.99,121.18 D12.C 69.65,123.84 v69.65,129.54 | IC5.12 v62.59,134.85
  Bottom 0.254: v62.59,134.85 69.01,134.85 69.65,134.21 v69.65,129.54
BUFIN4  (via drill 0.25)
  Top 0.254: D15.C 59.14,178.36 R127.2 65.84,178.36 D14.C 69.04,181.55 v69.04,188.39 | IC8.12 58.07,191.59 v60.12,191.59
  Bottom 0.254: v60.12,191.59 65.84,191.59 v69.04,188.39
BUFIN5  (via drill 0.25)
  Top 0.254: D17.C 100.95,121.22 R128.2 103.92,121.59 D16.C 107.49,125.16 107.49,128.14 108.86,129.51 v108.86,131.37 | IC6.12 v100.56,134.72
  Bottom 0.254: v100.56,134.72 108.23,134.72 108.86,134.09 v108.86,131.37
BUFIN6  (via drill 0.25)
  Top 0.254: D19.C 98.06,176.1 R129.2 D18.C 105.28,179.57 v105.28,186.13 | IC7.12 v96.83,189.2
  Bottom 0.254: v96.83,189.2 102.21,189.2 v105.28,186.13
BUFIN7  (via drill 0.25)
  Top 0.254: IC9.12 v137.26,133.27 | v145.49,130.1 143.64,128.24 143.64,121.12 143,120.49 D20.C 141.36,120.47 R130.2 138.5,120.5 D21.C
  Bottom 0.254: v137.26,133.27 144.86,133.27 145.49,132.64 v145.49,130.1
BUFIN8  (via drill 0.25)
  Top 0.254: D23.C 137.18,176.36 R131.2 139.89,176.33 D22.C 144.09,180.54 v144.09,186.84 | IC10.12 v135.74,189.66
  Bottom 0.254: v135.74,189.66 141.28,189.66 v144.09,186.84
CBUS4
  Top 0.406: IC1.12 arc45 IC1.12 JP6.3
D+  (via drill 0.25)
  Top 0.406: IC1.15 7.8,41.47 v7.72,26.95
  Bottom 0.406: v7.72,26.95 10.29,24.46 R8.1
D-
  Top 0.406: R9.1 8.49,22 IC1.16
DACDIN  (via drill 0.25)
  Top 0.254: U1.44 60.71,53.9 61.34,54.54 v61.34,54.56 | v61.34,62.48 61.34,65.66 70.21,74.52 72.83,74.52 U2.2
  Bottom 0.254: v61.34,54.56 v61.34,62.48
DACDOUT  (via drill 0.25)
  Top 0.254: U1.42 61.05,52.9 61.06,52.91 61.11,52.91 v62.69,54.23 | v63.4,68.68 63.4,72.52 65.38,74.5 67.2,74.5 U2.19
  Bottom 0.254: v62.69,54.23 63.4,54.94 v63.4,68.68
DACO1  (1 unrouted)
  Top 0.254: JP19.2 4.65,118.29 5,117.93 | U2.12 65.23,79.06 64.59,79.69 64.59,82.91
DACO2  (1 unrouted)
  Top 0.254: JP20.2 5.03,184.79 5.03,173
DACO3  (1 unrouted)
  Top 0.254: U2.14 64.26,77.76 63.63,78.39 63.63,83.01 | JP21.2 44.09,118.24 44.12,118.21
DACO4  (1 unrouted)
  Top 0.254: JP22.2 41.94,171.04 41.83,170.94
DACO5  (1 unrouted)
  Top 0.254: U2.6 75.18,77.11 75.82,77.74 75.82,83.08 | JP13.2 82.12,115.62 82.27,115.47
DACO6  (1 unrouted)
  Top 0.254: U2.7 74.68,77.76 75.31,78.39 75.31,83.11 | JP16.2 79.27,172.47 79.15,172.34
DACO7  (1 unrouted)
  Top 0.254: U2.8 74.17,78.41 74.8,79.04 74.8,83.11 | JP17.2 118.85,116.76 118.77,116.69
DACO8  (1 unrouted)
  Top 0.254: U2.9 73.69,79.06 74.32,79.69 74.32,83.08 | JP18.2 118.44,186.03 118.44,171.78
DTR_RESET
  Top 0.254: R10.1 21.61,54.76 Q2.B
FS  (via drill 0.25)
  Top 0.254: U1.31 53.36,49.46 v54.2,48.97 | U2.4 74.56,75.81 75.67,74.7 75.67,72.42 78.33,69.75 88.21,69.75 89.74,68.22 89.74,63.09 88.24,61.6 79.78,61.6 78.23,60.05 74.35,60.05 v71.7,57.66
  Bottom 0.254: v54.2,48.97 64.9,48.97 71.7,55.78 v71.7,57.66
GND  (57 unrouted)
  Top 0.254: U7.1 U7.2 | S2.3 S2.4 | C6.2 39.88,55.6
  Top 0.406: IC1.25 IC1.26
GPIO34  (via drill 0.25)
  Top 0.254: JP64.2 22.25,74.7 R3.2 26.82,73.48 v30,73.48 | U1.55 61.76,59.4 63.32,60.96 65.2,60.96 65.66,61.42 68.45,61.42 69.85,60.02 69.85,57.73 70.61,56.97 86.08,56.97 R120.2 85.34,57.71 v85.34,60.83 | v85.34,69.09 v85.34,62.64
  Bottom 0.254: v30,73.48 34.01,69.47 61.27,69.47 62.84,71.04 66.19,71.04 68.15,69.09 v85.34,69.09 | v85.34,62.64 v85.34,60.83
IDK
  Top 0.406: JP5.2 96.29,5.92 R110.2 96.22,5.89 C31.1 92.36,5.87 C22.+ 79.53,5.87 IC13.3 79.4,8.08 D3.A 84.33,13 D4.C
IDK2  (1 unrouted)
  Top 0.406: R111.2 76.89,28.17 D5.C 76.25,28.17 D10.A 78.33,25.98 78.33,23.24 C37.- 82.63,22.15 C4.1 JP32.2
IN1
  Bottom 0.254: JP19.1 4.7,131.47 7.95,131.47 8.89,132.41 R37.1
IN2
  Bottom 0.254: R30.1 9.25,188.11 8.64,187.5 4.57,187.5 JP20.1
IN3
  Bottom 0.254: R35.1 47.91,134.29 47.07,133.45 JP21.1
IN4
  Bottom 0.254: R50.1 45.57,190.14 44.93,189.51 JP22.1
IN5
  Bottom 0.254: R54.1 84.1,136.47 JP13.1
IN6
  Bottom 0.254: R76.1 81.58,190.45 JP16.1
IN7
  Bottom 0.254: JP17.1 121.84,133.45 R88.1
IN8
  Bottom 0.254: R92.1 120.85,191.08 JP18.1
INT_CONTROL  (8 unrouted)
INTINP1  (1 unrouted)
  Top 0.254: JP46.1 5.21,134.32 6.04,133.48 7.52,133.48 8.71,132.28 8.71,128.45 R17.1 6.58,126.26 6.58,118.39 | U9.5 51.21,87 51.84,87.63 51.84,101.73
INTINP2  (1 unrouted)
  Top 0.254: JP47.1 4.95,189.87 5.49,189.33 7.54,189.33 8.43,188.44 8.43,184.86 | 8.43,184.86 R18.1 | U9.7 49.81,89.54 50.44,90.17 50.44,101.8 | 8.43,184.86 6.93,183.36 6.93,172.64
INTINP3  (1 unrouted)
  Top 0.254: JP48.1 43.97,135.61 44.53,135.05 46.53,135.05 47.42,134.16 47.42,131.04 R19.1 45.47,129.08 45.47,118.49 | U9.9 48.26,92.08 48.9,92.71 48.9,101.68
INTINP4  (1 unrouted)
  Top 0.254: U9.11 46.61,94.62 47.24,95.25 47.24,101.73 | JP49.1 41.96,192.07 42.6,191.44 44.53,191.44 45.16,190.8 R20.1 44.98,187.63 44.98,186.59 43.31,184.91 43.31,171.32
INTINP5  (1 unrouted)
  Top 0.254: JP42.1 84.66,135.74 84.66,132.97 85.27,132.36 R25.1 82.78,128.3 82.78,114.96 | U9.14 33.76,94.62 33.12,95.25 33.12,101.63
INTINP6  (1 unrouted)
  Top 0.254: U9.16 32.18,92.08 31.55,92.71 31.55,101.63 | JP43.1 81.51,189.97 81.51,186.36 R78.1 79.93,182.4 79.93,172.49
INTINP7  (1 unrouted)
  Top 0.254: U9.18 30.58,89.54 29.95,90.17 29.95,101.7 | JP44.1 121.18,134.47 121.18,130.53 R94.1 121.08,129.46 120.24,128.63 120.24,116.31 120.32,116.23
INTINP8  (1 unrouted)
  Top 0.254: U9.20 28.85,87 28.22,87.63 28.22,101.63 | JP45.1 121.03,190.3 121.03,187.3 122.5,185.83 R96.1 119.38,182.6 119.38,172.03
INTSWITCH1  (1 unrouted)
  Top 0.254: R117.2 14.58,120.8 14.58,117.63
INTSWITCH2  (1 unrouted)
  Top 0.254: R116.2 14.12,173.56 14.3,173.38
INTSWITCH3  (1 unrouted)
  Top 0.254: R115.2 53.01,118.87 53.06,118.82
INTSWITCH4  (1 unrouted)
  Top 0.254: R114.2 51.05,178.84 51.05,173.58
INTSWITCH5  (1 unrouted)
  Top 0.254: R112.2 91.26,122.99 91.26,117.5
INTSWITCH6  (1 unrouted)
  Top 0.254: R109.2 88.09,176.4 88.09,172.03
INTSWITCH7  (1 unrouted)
  Top 0.254: R108.2 127.94,121.51 127.94,117.27
INTSWITCH8  (1 unrouted)
  Top 0.254: R107.2 127.1,172.24 127.15,172.19
JTAG_TRST
  Bottom 0.254: JP64.5 20.98,68.35 61.82,68.35 63.5,70.03 65.18,70.03 68.43,66.78 SV1.2
LDACBAR  (via drill 0.25)
  Top 0.254: U1.52 62.6,57.9 v62.71,58.04 | v62.71,68 62.71,72.54 65.33,75.16 U2.18
  Bottom 0.254: v62.71,58.04 v62.71,68
LED1
  Top 0.254: R113.2 86.21,51.59 81.08,51.59 80.11,52.55 80.11,54.33 77.98,56.46 70.43,56.46 69.32,57.58 69.32,59.23 68.63,59.92 63.6,59.92 63.26,59.58 63.14,59.46 62.08,58.4 U1.53
LIMO1  (via drill 0.25)
  Top 0.254: v23.65,136.65 22.74,136.65 IC3.14 IC3.13
  Bottom 0.254: v23.65,136.65 32.23,136.65 JP65.3
LIMO2  (via drill 0.25)
  Top 0.254: v24.94,192.61 22.72,192.61 IC4.14 IC4.13
  Bottom 0.254: v24.94,192.61 32.94,192.61 JP66.3
LIMO3  (via drill 0.25)
  Top 0.254: v62.59,138.02 61.3,138.02 IC5.14 IC5.13
  Bottom 0.254: v62.59,138.02 71.93,138.02 JP67.3
LIMO4  (via drill 0.25)
  Top 0.254: v61.65,194.89 58.73,194.89 IC8.14 IC8.13
  Bottom 0.254: v61.65,194.89 69.77,194.89 JP68.3
LIMO5  (via drill 0.25)
  Top 0.254: IC6.13 IC6.14 99.93,138.28 v101.85,138.28
  Bottom 0.254: v101.85,138.28 109.53,138.28 JP69.3
LIMO6  (via drill 0.25)
  Top 0.254: IC7.13 IC7.14 95.39,192.08 96.39,193.09 v98.63,193.09
  Bottom 0.254: v98.63,193.09 105.54,193.09 JP70.3
LIMO7  (via drill 0.25)
  Top 0.254: IC9.13 IC9.14 136.71,136.88 v138.56,136.88
  Bottom 0.254: v138.56,136.88 147.34,136.88 JP71.3
LIMO8  (via drill 0.25)
  Top 0.254: IC10.13 IC10.14 134.88,192.86 137.52,192.86 v137.54,192.89
  Bottom 0.254: v137.54,192.89 144.42,192.89 JP72.3
N$1
  Top 0.254: C5.1 43.94,63.88 44.58,63.25 44.58,62.04 45.21,61.4 U1.2
N$2
  Top 0.254: C6.1 44.45,55.6 45.24,56.39 U1.12
N$3
  Top 0.254: C7.1 52.36,47.54 U1.29
N$4
  Top 0.254: U1.51 63.17,57.4 63.35,57.58 63.35,57.89 63.98,58.52 C8.1
N$5
  Top 0.254: C9.1 57.68,66.57 56.97,66.57 55.85,65.46 U1.65
N$6
  Top 0.254: R10.2 15.62,51.92 IC1.2
N$7
  Top 0.254: L3.1 43.92,50.31 44,50.39 | U1.20 46,52.4 44,50.39 | C11.1 44,50.39
N$8
  Top 0.254: U1.72 C18.1
N$9
  Top 0.254: R5.1 15.52,74.75 JP64.1
N$10
  Top 0.254: JP64.3 19.41,71.96 R4.1
N$11
  Top 0.406: CON1.2 R9.2
N$12  (via drill 0.25)
  Top 0.406: CON1.3 8.51,14.02 v8.53,14.05
  Bottom 0.406: v8.53,14.05 10.29,15.8 R8.2
N$13  (via drill 0.25)
  Top 0.406: IC1.19 arc90 10.39,41.46 v10.39,39.98
  Bottom 0.406: v10.39,39.98 10.39,39.88 arc-90 9.75,39.37 R11.1
N$14
  Top 0.406: IC1.22 12.37,37.44 13,36.8 RXLED.C
N$15
  Top 0.406: IC1.23 13.02,40.3 TXLED.C
N$16
  Top 0.406: RXLED.A 13.44,30.17 R12.1
N$17
  Top 0.406: TXLED.A R13.1
N$20
  Top 0.254: R22.1 11.3,182.12 R18.2 IC4.6 | R22.1 C25.1 | C25.1 | C25.1 11.25,176.68 R116.1 | R44.2 11.18,181.99 R22.1
N$21
  Top 0.254: R23.1 50.22,127.86 R19.2 55.34,130.99 arc45 IC5.6 | R23.1 50.16,125.4 C26.1 R115.1 | R45.2 R23.1 | R23.1
N$22
  Top 0.254: IC8.6 52.8,187.81 R20.2 48.01,184.3 R24.1 | R24.1 47.98,181.69 C27.1 R114.1 | R46.2 47.85,184.15 R24.1
N$23
  Top 0.254: IC4.2 18.52,190.47 19.2,191.16 19.18,194.16 | 19.18,194.16 R29.1 | 19.18,194.16 21.61,194.16 R28.2
N$24
  Bottom 0.254: R15.1 SV1.13
N$25
  Bottom 0.254: R16.1 SV1.14
N$26  (via drill 0.25)
  Top 0.254: v14.53,190.07 15.39,189.2 IC4.3
  Bottom 0.254: v14.53,190.07 12.04,190.07 R30.2 R32.2
N$28
  Top 0.254: R38.2 8.74,125.63 R21.1 | R21.1 11.61,128.4 R17.2 11.58,128.65 12.22,129.29 IC3.6 | R21.1 11.61,123.26 C24.1 R117.1
N$29
  Top 0.254: IC3.2 18.72,134.37 19.35,135 R31.1 21.79,138.53 R27.2
N$30
  Top 0.254: R26.1 88.16,130.73 R25.2 93.59,130.78 IC6.6 | R26.1 C28.1 88.16,123.29 R112.1 | R47.2 86.51,126.82 R26.1
N$31
  Top 0.254: IC5.2 57.35,136.12 58.12,136.88 R34.1 | R34.1 | R34.1 60.73,139.62 R33.2
N$33  (via drill 0.35)
  Top 0.254: IC3.3 14.71,133.1 v14.1,133.71
  Bottom 0.254: R42.2 11.56,134.54 R37.2 13.92,133.88 v14.1,133.71
N$35  (via drill 0.25)
  Top 0.254: v53.29,135.94 54.38,134.85 IC5.3
  Bottom 0.254: R36.2 50.75,138.28 R35.2 50.8,135.94 v53.29,135.94
N$36
  Top 0.254: R39.2 R40.1 24.16,129.29 IC3.9
N$38  (1 unrouted)
  Top 0.254: IC3.10 22.08,130.2 26.21,130.2 28.07,132.05 R41.2
N$39
  Top 0.254: IC8.2 55.14,192.91 55.68,193.45 R49.1 55.73,196.39 R48.2
N$40  (via drill 0.25)
  Top 0.254: IC8.3 51.16,191.64 v51.08,191.72
  Bottom 0.254: v51.08,191.72 50.24,192.56 R50.2 R51.2
N$41
  Top 0.254: IC7.2 92,190.47 92.53,191.01 92.53,193.5 R75.1 95.38,194.51 R74.2
N$42
  Top 0.254: IC6.2 95.86,135.99 96.32,136.45 96.32,139.12 R53.1 98.63,140.11 R52.2
N$44  (via drill 0.25)
  Top 0.254: v91.26,135.53 92.08,134.72 IC6.3
  Bottom 0.254: R54.2 90.12,136.22 | 90.12,136.22 89.23,137.11 R55.2 | 90.12,136.22 90.58,136.22 v91.26,135.53
N$45  (via drill 0.25)
  Top 0.254: v87.73,190.32 88.85,189.2 IC7.3
  Bottom 0.254: R77.2 R76.2 85.98,190.32 v87.73,190.32
N$47
  Top 0.254: R56.2 28.17,184.71 R57.1 24.66,185.39 IC4.9
N$48
  Top 0.254: R59.2 28.7,190.73 R58.2 28.7,187.33 26.7,186.31 22.21,186.31 IC4.10
N$49
  Top 0.254: IC5.9 63.7,131.04 R61.1 67.16,130.63 R60.2
N$50
  Top 0.254: R63.2 67.79,133.91 R62.2 66.19,132.31 IC5.10
N$51
  Top 0.254: R64.2 65.66,187.68 R65.1 62.08,187.83 IC8.9
N$52
  Top 0.254: R67.2 65.43,193.09 R66.2 64.31,189.1 IC8.10
N$53
  Top 0.254: IC6.9 99.4,130.43 101.78,130.43 R69.1 105.44,130.56 R68.2
N$54
  Top 0.254: R71.2 105,133.3 R70.2 103.99,132.18 IC6.10
N$55  (1 unrouted)
  Top 0.254: R79.1 85.24,181.61 C35.1 85.24,176.55 R109.1 | R78.2 85.55,181.96 R79.1 | R73.2 85.17,181.58 R79.1
N$56
  Top 0.254: IC7.9 97.74,185.39 R81.1 R80.2
N$57
  Top 0.254: R83.2 101.47,187.93 R82.2 100.31,186.66 IC7.10
N$58
  Top 0.254: IC9.2 132.31,134.54 132.79,135.03 132.84,135.31 R87.1 132.87,138.84 R86.2
N$59  (via drill 0.25)
  Top 0.254: v128.12,134.52 129.36,133.27 IC9.3
  Bottom 0.254: R89.2 126.08,134.9 R88.2 126.47,134.52 v128.12,134.52
N$60
  Top 0.254: IC10.2 131.27,190.93 131.83,191.49 131.83,195.3 R91.1 134.16,195.33 R90.2
N$61  (via drill 0.25)
  Top 0.254: v126.9,190.63 127.86,189.66 IC10.3
  Bottom 0.254: v126.9,190.63 126.44,191.08 R92.2 124.74,193.65 R93.2
N$62
  Top 0.254: IC9.6 R94.2 125.09,126.72 R95.1 | R95.1 125.07,124.18 C38.1 125.09,121.57 R108.1 | R84.2 R95.1
N$63
  Top 0.254: R97.1 C39.1 | C39.1 | R85.2 R97.1 | R97.1 124.26,184.63 R96.2 129,185.83 IC10.6 | C39.1 R107.1
N$64
  Top 0.254: IC9.9 138.2,129.46 R99.1 R98.2
N$65
  Top 0.254: IC9.10 140.34,130.73 R100.2 141.68,135.1 R101.2
N$66
  Top 0.254: IC10.9 136.68,185.85 R103.1 140.41,185.67 R102.2
N$67
  Top 0.254: R104.2 140.18,188.65 | 140.18,188.65 140.18,191.11 R105.2 | IC10.10 138.89,187.12 140.18,188.65
N$73
  Top 0.406: 59.04,5.59 D6.C | D9.C 55.3,5.59 59.04,5.59 | 59.04,5.59 59.06,5.61 C32.1 64.09,5.72 C33.+ IC13.1 74.32,8.03 D3.C
N$77
  Top 0.254: U7.6 U7.5 33.93,25.17 C40.+ 27.96,23.52 JP30.2 27.99,21.16 R124.1
N$78
  Top 0.254: R123.1 35.43,27.71 C40.-
N$80
  Top 0.406: R111.1 88.44,29.57 LED6.K
N$81
  Top 0.254: U7.3 U7.4 44.5,24.89 C34.+ 44.6,23.7 40.49,19.58 40.49,18.75 39.85,18.11 JP31.1 JP31.3
N$82
  Top 0.406: LED5.A 95.61,16.03 R110.1
N$83
  Top 0.254: F3.1 6.27,13.91 6.91,13.27 CON1.1
N$86
  Top 0.406: D7.A 55.22,31.95 D8.A 60.68,29.77 60.68,20.24 62.36,18.57 | 62.36,18.57 C30.1 62.38,16.69 C23.- 69.75,18.01 D5.A | 62.36,18.57 63.58,19.79 64.87,19.79 66.75,21.67 IC2.2
N$91
  Top 0.254: U3.1 JP33.2
N$95
  Bottom 0.406: R11.2 4.93,56.67 arc-90 5.56,57.3 JP6.1
N$102
  Top 0.254: R113.1 90.65,46.15 T1.2
N$104
  Top 0.254: LED1.A T1.1 94.31,46.58 R118.1
N$105
  Top 0.254: LED1.K 92.18,38.58 R119.2
N$106
  Top 0.254: R120.1 86.18,54.13 88.92,56.87 T2.2
N$107
  Top 0.203: T2.1 91.97,51.77 LED2.A
  Top 0.254: T2.1 93.95,56.95 R121.1
N$108
  Top 0.203: LED2.K 92.23,48.92
  Top 0.254: 92.23,48.92 R122.2
N$131  (via drill 0.25)
  Top 0.254: U2.20 65.66,73.86 v65.58,73.79
  Bottom 0.254: JP55.2 63.07,73.79 v65.58,73.79
N$132
  Top 0.254: U4.1 JP2.2
N$133
  Top 0.254: U2.5 JP29.2
N$134
  Top 0.254: JP57.2 20.95,15.62 R106.2
N$135
  Top 0.254: U8.1 JP60.2
N$136
  Top 0.254: U10.1 JP62.2
OUT1  (via drill 0.25)
  Top 0.254: R40.2 24.94,125.65 R14.1 | IC3.8 21.73,126.31 22.36,125.68 R40.2 | v27.28,125.68 R40.2
  Bottom 0.254: JP65.1 34.24,126.31 33.6,125.68 v27.28,125.68
OUT2  (via drill 0.25)
  Top 0.254: R57.2 R125.1 | IC4.8 21.85,182.5 22.49,181.86 R57.2 | R57.2 v26.87,181.86
  Bottom 0.254: v26.87,181.86 34.29,181.86 34.92,182.5 JP66.1
OUT3  (via drill 0.25)
  Top 0.254: R126.1 R61.2 61.92,127.79 v61.11,128.6 60.66,129.05 IC5.8
  Bottom 0.254: v61.11,128.6 72.92,128.6 JP67.1
OUT4  (via drill 0.25)
  Top 0.254: IC8.8 58.02,185.47 58.66,184.84 R65.2 62.31,184.76 | 62.31,184.76 v63.96,184.76 | 62.31,184.76 62.33,184.73 R127.1
  Bottom 0.254: v63.96,184.76 68.17,184.76 JP68.1
OUT5  (via drill 0.25)
  Top 0.254: R128.1 101.91,125.02 R69.2 100.58,127.71 v99.97,128.32 99.55,128.32 98.92,128.96 IC6.8
  Bottom 0.254: v99.97,128.32 110.87,128.32 111.51,128.96 JP69.1
OUT6  (via drill 0.25)
  Top 0.254: 98.35,181.94 R81.2 96.02,181.99 95.39,182.63 IC7.8 | 98.35,181.94 R129.1 | 98.35,181.94 | 98.35,181.94 v99.8,181.94
  Bottom 0.254: v99.8,181.94 103.78,181.94 JP70.1
OUT7  (via drill 0.25)  (1 unrouted)
  Top 0.254: IC9.8 135.65,127.07 v136.27,126.44 138.38,126.44 R99.2
  Bottom 0.254: v136.27,126.44 147.75,126.44 148.39,127.08 JP71.1
OUT8  (via drill 0.25)
  Top 0.254: IC10.8 134.22,183.46 134.86,182.83 R103.2 | R131.1 137.21,182.47 R103.2 | R103.2 136.91,182.78 v138.63,182.78
  Bottom 0.254: v138.63,182.78 143.28,182.78 JP72.1
PLS1  (via drill 0.25)
  Top 0.254: v26.98,124.18 28.04,124.18 R39.1
  Bottom 0.254: JP36.1 19.15,124.18 v26.98,124.18
PLS2  (via drill 0.25)
  Top 0.254: v26.39,180.04 28.25,181.89 R56.1
  Bottom 0.254: JP37.1 19.02,180.04 v26.39,180.04
PLS3  (via drill 0.25)
  Top 0.254: v65.66,127.81 65.69,127.84 R60.1
  Bottom 0.254: JP38.1 57.35,127.81 v65.66,127.81
PLS4  (via drill 0.25)
  Top 0.254: v64.01,182.91 65.71,184.61 R64.1
  Bottom 0.254: JP39.1 54.91,182.91 v64.01,182.91
PLS5  (via drill 0.25)
  Top 0.254: v103.68,127.58 | v103.68,127.58 R68.1
  Bottom 0.254: JP7.1 94.97,127.58 v103.68,127.58
PLS6  (via drill 0.25)
  Top 0.254: v99.9,180.14 101.45,181.69 R80.1
  Bottom 0.254: JP23.1 92.69,180.14 v99.9,180.14
PLS7  (via drill 0.25)
  Top 0.254: v140.08,125.63 139.93,125.65 140.56,126.29 R98.1
  Bottom 0.254: JP34.1 131.9,125.63 v140.08,125.63
PLS8  (via drill 0.25)
  Top 0.254: v138.71,180.7 140.44,182.42 R102.1
  Bottom 0.254: JP35.1 131.62,180.7 v138.71,180.7
RES
  Top 0.254: R124.2 30.79,17.66 U7.8
RESET#  (via drill 0.25)
  Top 0.254: S2.2 S2.1 9.22,71.32 9.22,74.73 R6.1 | S2.2 9.15,64.75 | S2.2 9.07,64.67 C3.1 10.47,59.46 17.75,59.46 19.89,57.33 Q2.E | U1.9 44.79,57.9 v44.53,58.17
  Bottom 0.254: v44.53,58.17 22.28,58.17 21.64,57.53 Q2.E
RXD
  Top 0.203: IC1.5 13.66,58.17
  Top 0.406: FTDI.2 13.66,58.17
SPIBCLK  (via drill 0.25)
  Top 0.254: U9.1 46.35,81.92 v47.4,80.87 | v47.4,78.99 47.4,66.85 49,65.25 49.91,65.25 50.36,64.8 U1.76
  Bottom 0.254: v47.4,80.87 v47.4,78.99
SPIBMISO  (via drill 0.25)
  Top 0.254: U9.22 41.55,84.46 v42.49,85.39 | v48.23,79.07 48.23,66.95 49.33,65.86 49.96,65.86 50.86,64.96 U1.75
  Bottom 0.254: v42.49,85.39 47.6,85.39 48.23,84.76 v48.23,79.07
SPIBMOSI  (via drill 0.25)
  Top 0.254: U9.3 42.65,84.46 v42.34,84.15 | v34.7,70.26 v34.7,61.72 | v34.7,59.54 37.54,56.69 37.54,47.5 38.86,46.18 v49.23,46.18 | v55.35,48.23 55.36,48.25 U1.35
  Bottom 0.254: v42.34,84.15 42.37,84.12 42.37,79.12 34.7,71.45 v34.7,70.26 | v34.7,61.72 v34.7,59.54 | v49.23,46.18 49.25,46.15 54.13,46.15 55.35,47.37 v55.35,48.23
SPIBSS
  Top 0.254: U9.24 37.48,79.91 50.62,79.91 53.7,76.84 53.7,66.19 53.36,65.86 U1.70
SPICLK  (via drill 0.25)
  Top 0.254: U1.41 61.44,52.4 v61.47,52.37 | U2.3 74.5,75.16 75.13,74.52 75.13,73.15 65.35,63.37 v61.98,63.37
  Bottom 0.254: v61.47,52.37 62.05,52.96 v61.98,63.37
SV1-1
  Top 0.406: D9.A 55.19,15.72 | JP14.3 55.22,15.65 D9.A | D7.C 55.24,21.72 D9.A
SV1-3
  Top 0.406: D8.C 58.52,21.77 D6.A
  Bottom 0.406: JP14.1 52.02,20.02 56.72,20.02 D8.C
SWITCH1  (1 unrouted)
  Top 0.254: U9.6 50.44,88.27 51.08,88.9 51.08,101.8 | R38.1 8.69,118.85 8.56,118.72
SWITCH2  (1 unrouted)
  Top 0.254: U9.8 49.07,90.81 49.71,91.44 49.71,101.78 | R44.1 8.74,178.99 8.74,173.41
SWITCH3  (1 unrouted)
  Top 0.254: U9.10 47.35,93.35 47.98,93.98 47.98,101.73 | R45.1 47.12,118.49 47.14,118.47
SWITCH4  (1 unrouted)
  Top 0.254: U9.12 44.84,101.71 44.86,101.73 | R46.1 44.91,181.2 44.91,171.58
SWITCH5  (1 unrouted)
  Top 0.254: U9.13 35.61,96.02 35.61,101.78 | R47.1 84.38,115.44 84.12,115.19
SWITCH6  (1 unrouted)
  Top 0.254: U9.15 33.02,93.35 32.38,93.98 32.38,101.68 | R73.1 81.74,178.51 81.74,172.19
SWITCH7  (1 unrouted)
  Top 0.254: U9.17 31.42,90.81 30.79,91.44 30.79,101.63 | R84.1 122.17,117.25 122.15,117.22
SWITCH8  (1 unrouted)
  Top 0.254: R85.1 121.67,172.34 121.69,172.31
TCK  (via drill 0.25)
  Top 0.254: U1.54 61.95,58.9 63.45,60.4 v67.97,60.58
  Bottom 0.254: SV1.11 SV1.9 77.9,60.58 v67.97,60.58
TDI
  Top 0.254: U1.57 61.37,60.4 63.35,62.38 72.08,62.38 SV1.3
TDO  (via drill 0.25)
  Top 0.254: JP64.4 22.23,72.24 R2.2 26.82,71.04 v30.12,71.04 | U1.56 61.55,59.9 63.52,61.87 76.66,61.87 SV1.7 78.97,64.24 77.72,65.48 v77.72,68.43
  Bottom 0.254: v30.12,71.04 32.26,68.91 61.52,68.91 63.14,70.54 65.73,70.54 67.84,68.43 v77.72,68.43
TMS
  Top 0.254: U1.58 61.2,60.9 63.22,62.92 70.08,62.92 SV1.1
TMS_RXD  (via drill 0.25)
  Top 0.254: U1.40 | U1.40 v57.86,48.23 | v49.23,45.31 39.04,45.31 36.93,47.42 36.93,56.13 32.31,60.76 16.26,60.76 FTDI.3
  Bottom 0.254: v57.86,48.23 54.69,45.31 v49.23,45.31
TMS_TXD  (via drill 0.25)  (1 unrouted)
  Bottom 0.254: FTDI.1 14.94,59.49 18.19,59.49 18.85,58.83 18.85,49.76 19.48,49.12 48.87,49.12 49.15,48.84 53.31,48.82 v54.2,48.13
TRST
  Top 0.254: JP64.6 22.23,69.7 R1.2 36.3,59.08 43.23,59.08 43.23,59.06 43.69,58.6 43.69,58.04 44.32,57.4 U1.10
TXD  (via drill 0.25)
  Top 0.254: v17.93,51 17.93,50.4 IC1.1
  Bottom 0.254: FTDI.4 17.3,58.19 17.93,57.56 v17.93,51
USB_VCC  (via drill 0.25)
  Top 0.254: F3.2 6.11,15.61 v6.15,15.57 | v8.66,15.57 15.06,15.57 JP57.1 15.11,13.03 15.75,12.4 37.34,12.4 37.97,13.03 JP31.2 39.65,15.57 48.9,24.82 48.9,32.56 48.87,32.59 48.87,34.44 55.5,41.07 59.56,41.07 63.98,45.49 82.53,45.49 91.19,36.83 v92.3,36.83 | JP29.3 81.79,70.33 88.62,70.33 90.32,68.63 90.32,61.54 v93.67,58.19
  Top 0.406: F3.2 C21.1 arc-90 C21.1 F1.1
  Bottom 0.254: v6.15,15.57 v8.66,15.57 | JP56.4 57.76,84.35 56.11,82.7 56.11,80.9 58.55,78.46 60.63,78.46 JP55.3 73.51,78.61 JP29.3 | v93.67,58.19 93.67,38.2 v92.3,36.83
VCC  (via drill 0.25)
  Top 0.254: IC1.20 11.06,40.5 11.12,40.44 11.15,35.31 v10.29,34.44
  Top 0.406: F1.2 arc90 F1.2 C12.1 C19.1 v5.97,29.24
  Bottom 0.406: v5.97,29.24 9.65,29.24 arc90 10.29,29.87 v10.29,34.44
VDDIO  (via drill 0.25)  (1 unrouted)
  Top 0.254: U1.30 52.86,48.56 v54.15,47.27 54.99,47.27 55.63,46.63 C15.1 56.61,46.33 v57.15,45.72 | U1.49 59.74,56.41 C16.1 64.69,55.1 v64.77,54.99 | U1.63 56.86,64.68 57.24,65.06 | C10.1 50.16,67.26 51.36,66.06 v51.36,65.41 v51.36,65.4 U1.74 | U1.11 44.3,56.9 v43.94,56.54 42.77,57.71 C14.1 | v44.91,50.17 v44.91,46.96 | v62.05,65.43 62,65.41 v65.53,65.41 | 59.89,67.72 57.61,65.43 | 57.61,65.43 57.24,65.06 | v60.63,65.43 57.61,65.43 | v56.82,65.41 56.9,65.41 57.24,65.06 | C13.1 v43.79,61.67 45.06,60.4 U1.4 | v64.77,49.81 v64.77,48.18
  Bottom 0.254: L1.1 41.78,35.66 42.52,36.4 42.52,40.11 43.81,41.4 44.86,41.4 | 44.86,41.4 45.47,41.4 46.69,40.18 47.95,40.18 48.59,40.82 48.59,46.63 49.23,47.27 v54.15,47.27 | R15.2 92.13,65.51 | 92.13,65.51 R16.2 | 92.13,65.51 77.75,65.51 SV1.5 75.31,65.41 v65.53,65.41 65.53,55.75 v64.77,54.99 | v64.77,49.81 v64.77,54.99 | 64.77,55.02 v64.77,54.99 | v43.94,56.54 43.94,51.13 v44.91,50.17 | v44.91,46.96 44.91,41.45 44.86,41.4 | v60.63,65.43 v62.05,65.43 | v56.82,65.41 v51.36,65.41 45.34,65.41 43.79,63.86 v43.79,61.67 | v57.15,45.72 62.31,45.72 v64.77,48.18
X1  (1 unrouted)
  Top 0.254: R21.2 14.45,125.94 | 14.45,123.24 C24.2 14.73,122.94 JP36.2 17.86,114.71 | 14.45,123.24 R21.2 | 14.45,123.24 14.48,123.24 | 14.48,123.24 14.48,123.27 | IC3.7 14.96,128.02 14.43,127.48 14.43,125.65 R21.2 | 14.48,123.24 14.78,122.94
X1CLK
  Top 0.254: U1.48 62.59,55.9 64.16,54.33 65.25,54.33 65.89,54.97 Q1.2
  Bottom 0.254: R7.2 Q1.2 C1.1
X1DOT  (via drill 0.25)
  Top 0.254: IC3.1 16.53,138.52 R31.2 14.4,138.53 v14.38,138.56
  Bottom 0.254: v14.38,138.56 5.23,138.56 JP46.2
X2  (1 unrouted)
  Top 0.254: IC4.7 14.73,184.12 14.3,183.69 14.3,182.27 R22.2 14.1,179.55 C25.2 14.73,178.82 JP37.2 17.78,178.74 17.78,170.89
X2CLK
  Top 0.254: U1.47 62.43,55.4 63.93,53.9 65.46,53.9 69.22,50.14 Q1.1
  Bottom 0.254: R7.1 Q1.1 C2.1
X2DOT  (via drill 0.25)  (1 unrouted)
  Top 0.254: R29.2 15.88,194.08 v14.58,194.08
  Bottom 0.254: JP47.2 v14.58,194.08
X3  (1 unrouted)
  Top 0.254: IC5.7 53.72,129.77 53.06,129.11 53.06,127.2 53.09,127.18 53.09,127.74 R23.2 C26.2 53.9,124.46 JP38.2 56.52,124.43 56.52,116.13
X3DOT  (via drill 0.25)  (1 unrouted)
  Top 0.254: v53.44,139.65 53.47,139.62 R34.2
  Bottom 0.254: JP48.2 43.99,139.65 v53.44,139.65
X4  (1 unrouted)
  Top 0.254: 50.75,183.77 C27.2 51.26,181.15 JP39.2 54.15,181.13 54.15,172.69 | 50.75,183.77 50.75,184.2 R24.2 | IC8.7 51.56,186.56 50.8,185.8 50.8,183.82 50.75,183.77
X4DOT  (via drill 0.25)  (1 unrouted)
  Top 0.254: v50.7,196.47 50.72,196.44 R49.2
  Bottom 0.254: JP49.2 v50.7,196.47
X5  (1 unrouted)
  Top 0.254: IC6.7 92.18,129.64 R26.2 91.01,125.88 C28.2 91.01,125.88 92.61,124.28 JP7.2 94.21,116.64
X5DOT  (via drill 0.25)
  Top 0.254: v91.24,140.56 92.81,140.56 R53.2 93.72,139.66 IC6.1
  Bottom 0.254: JP42.2 v91.24,140.56
X6  (1 unrouted)
  Top 0.254: IC7.7 88.06,182 R79.2 88.06,179.07 | 88.06,179.07 C35.2 | 88.06,179.07 88.34,178.79 JP23.2
X6DOT  (via drill 0.25)
  Top 0.254: v87.68,194.46 87.73,194.51 89.46,194.51 | 89.46,194.51 R75.2 | IC7.1 90.19,193.79 89.46,194.51
  Bottom 0.254: JP43.2 v87.68,194.46
X7  (1 unrouted)
  Top 0.254: IC9.7 128.95,126.7 R95.2 127.91,124.18 | 127.91,124.18 C38.2 | 127.91,124.18 129.54,124.18 JP34.2 131.32,122.4 131.32,117.25
X7DOT  (via drill 0.25)
  Top 0.254: IC9.1 130,136.26 R87.2 129.44,139.42 v127.08,139.42
  Bottom 0.254: JP44.2 127,139.34 v127.08,139.42
X8  (1 unrouted)
  Top 0.254: 127.1,179.27 R97.2 127.1,182.66 IC10.7 | 127.1,179.27 C39.2 | 127.1,179.27 130.45,179.27 JP35.2
X8DOT  (via drill 0.25)
  Top 0.254: v127.03,195.3 127.05,195.33 128.98,195.33 | 128.98,195.33 R91.2 | IC10.1 129.02,195.28 128.98,195.33
  Bottom 0.254: JP45.2 118.62,195.3 v127.03,195.3